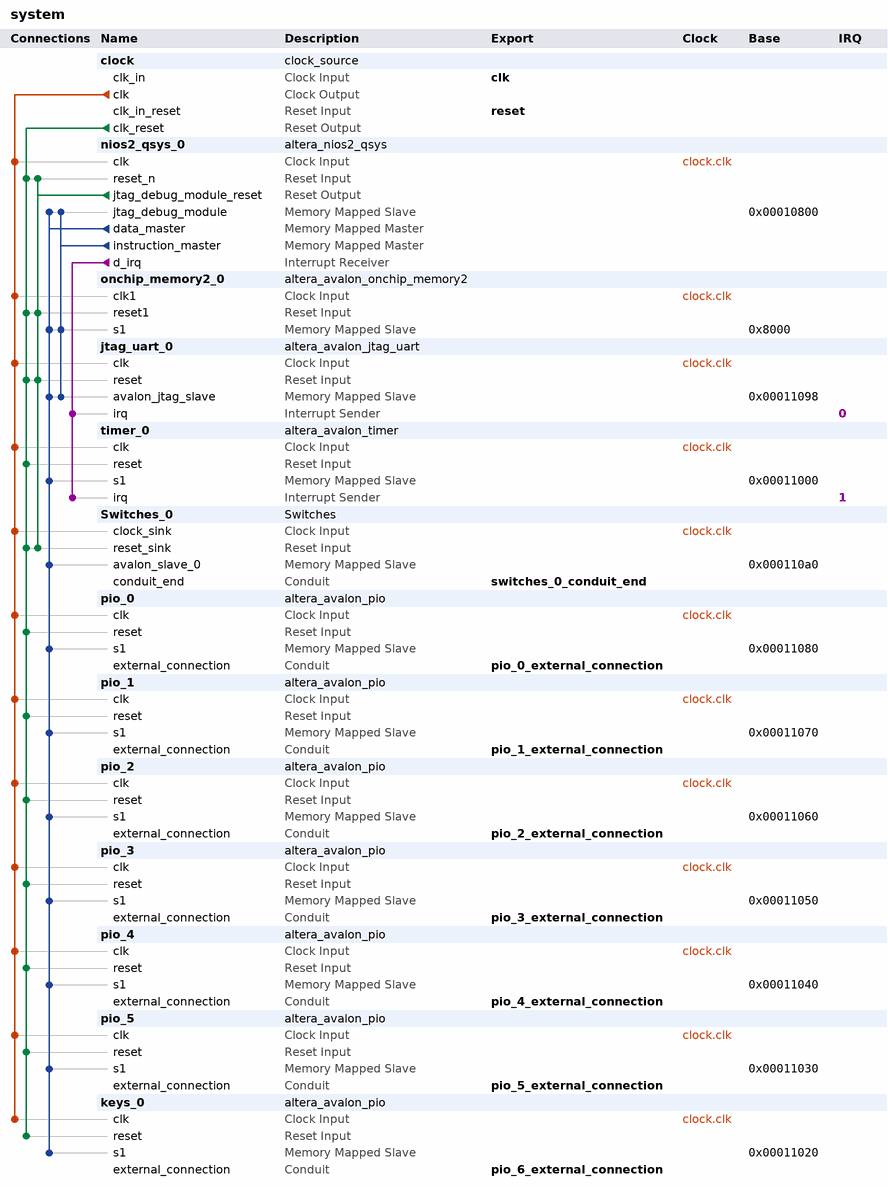
[diagram p0: system contents]
# Platform Designer (Qsys) system system, Cyclone II EP2C35F672C6
# Parameters at their usual value, and those the tool derives, are not listed.
package require -exact qsys 13.0.1.99.2
create_system system
set_project_property DEVICE_FAMILY {Cyclone II}
set_project_property DEVICE EP2C35F672C6

add_instance clock clock_source 13.0
set_instance_parameter_value clock clockFrequency 50000000

add_instance nios2_qsys_0 altera_nios2_qsys 13.0
set_instance_parameter_value nios2_qsys_0 resetSlave onchip_memory2_0.s1
set_instance_parameter_value nios2_qsys_0 mmu_TLBMissExcSlave None
set_instance_parameter_value nios2_qsys_0 exceptionSlave onchip_memory2_0.s1
set_instance_parameter_value nios2_qsys_0 breakSlave nios2_qsys_0.jtag_debug_module
set_instance_parameter_value nios2_qsys_0 impl Tiny
set_instance_parameter_value nios2_qsys_0 icache_size 4096

add_instance onchip_memory2_0 altera_avalon_onchip_memory2 13.0.1.99.2
set_instance_parameter_value onchip_memory2_0 dataWidth 32
set_instance_parameter_value onchip_memory2_0 dualPort false
set_instance_parameter_value onchip_memory2_0 initMemContent true
set_instance_parameter_value onchip_memory2_0 initializationFileName onchip_mem.hex
set_instance_parameter_value onchip_memory2_0 memorySize 32768

add_instance jtag_uart_0 altera_avalon_jtag_uart 13.0.1.99.2
set_instance_parameter_value jtag_uart_0 simInteractiveOptions NO_INTERACTIVE_WINDOWS

add_instance timer_0 altera_avalon_timer 13.0.1.99.2
set_instance_parameter_value timer_0 period 1
set_instance_parameter_value timer_0 periodUnits MSEC

add_instance Switches_0 Switches 1.0

add_instance pio_0 altera_avalon_pio 13.0.1.99.2
set_instance_parameter_value pio_0 direction Output
set_instance_parameter_value pio_0 width 8

add_instance pio_1 altera_avalon_pio 13.0.1.99.2
set_instance_parameter_value pio_1 direction Output
set_instance_parameter_value pio_1 width 8

add_instance pio_2 altera_avalon_pio 13.0.1.99.2
set_instance_parameter_value pio_2 direction Output
set_instance_parameter_value pio_2 width 4

add_instance pio_3 altera_avalon_pio 13.0.1.99.2
set_instance_parameter_value pio_3 direction Output
set_instance_parameter_value pio_3 width 4

add_instance pio_4 altera_avalon_pio 13.0.1.99.2
set_instance_parameter_value pio_4 direction Output
set_instance_parameter_value pio_4 width 4

add_instance pio_5 altera_avalon_pio 13.0.1.99.2
set_instance_parameter_value pio_5 direction Output
set_instance_parameter_value pio_5 width 4

add_instance keys_0 altera_avalon_pio 13.0.1.99.2
set_instance_parameter_value keys_0 captureEdge true
set_instance_parameter_value keys_0 direction Input
set_instance_parameter_value keys_0 irqType EDGE
set_instance_parameter_value keys_0 width 1

# connections
add_connection clock.clk jtag_uart_0.clk clock
add_connection clock.clk keys_0.clk clock
add_connection clock.clk nios2_qsys_0.clk clock
add_connection clock.clk onchip_memory2_0.clk1 clock
add_connection clock.clk pio_0.clk clock
add_connection clock.clk pio_1.clk clock
add_connection clock.clk pio_2.clk clock
add_connection clock.clk pio_3.clk clock
add_connection clock.clk pio_4.clk clock
add_connection clock.clk pio_5.clk clock
add_connection clock.clk Switches_0.clock_sink clock
add_connection clock.clk timer_0.clk clock
add_connection clock.clk_reset jtag_uart_0.reset reset
add_connection clock.clk_reset keys_0.reset reset
add_connection clock.clk_reset nios2_qsys_0.reset_n reset
add_connection clock.clk_reset onchip_memory2_0.reset1 reset
add_connection clock.clk_reset pio_0.reset reset
add_connection clock.clk_reset pio_1.reset reset
add_connection clock.clk_reset pio_2.reset reset
add_connection clock.clk_reset pio_3.reset reset
add_connection clock.clk_reset pio_4.reset reset
add_connection clock.clk_reset pio_5.reset reset
add_connection clock.clk_reset Switches_0.reset_sink reset
add_connection clock.clk_reset timer_0.reset reset
add_connection nios2_qsys_0.jtag_debug_module_reset jtag_uart_0.reset reset
add_connection nios2_qsys_0.jtag_debug_module_reset nios2_qsys_0.reset_n reset
add_connection nios2_qsys_0.jtag_debug_module_reset onchip_memory2_0.reset1 reset
add_connection nios2_qsys_0.jtag_debug_module_reset Switches_0.reset_sink reset
add_connection nios2_qsys_0.data_master jtag_uart_0.avalon_jtag_slave avalon
set_connection_parameter_value nios2_qsys_0.data_master/jtag_uart_0.avalon_jtag_slave baseAddress 0x00011098
add_connection nios2_qsys_0.data_master keys_0.s1 avalon
set_connection_parameter_value nios2_qsys_0.data_master/keys_0.s1 baseAddress 0x00011020
add_connection nios2_qsys_0.data_master nios2_qsys_0.jtag_debug_module avalon
set_connection_parameter_value nios2_qsys_0.data_master/nios2_qsys_0.jtag_debug_module baseAddress 0x00010800
add_connection nios2_qsys_0.data_master onchip_memory2_0.s1 avalon
set_connection_parameter_value nios2_qsys_0.data_master/onchip_memory2_0.s1 baseAddress 0x8000
add_connection nios2_qsys_0.data_master pio_0.s1 avalon
set_connection_parameter_value nios2_qsys_0.data_master/pio_0.s1 baseAddress 0x00011080
add_connection nios2_qsys_0.data_master pio_1.s1 avalon
set_connection_parameter_value nios2_qsys_0.data_master/pio_1.s1 baseAddress 0x00011070
add_connection nios2_qsys_0.data_master pio_2.s1 avalon
set_connection_parameter_value nios2_qsys_0.data_master/pio_2.s1 baseAddress 0x00011060
add_connection nios2_qsys_0.data_master pio_3.s1 avalon
set_connection_parameter_value nios2_qsys_0.data_master/pio_3.s1 baseAddress 0x00011050
add_connection nios2_qsys_0.data_master pio_4.s1 avalon
set_connection_parameter_value nios2_qsys_0.data_master/pio_4.s1 baseAddress 0x00011040
add_connection nios2_qsys_0.data_master pio_5.s1 avalon
set_connection_parameter_value nios2_qsys_0.data_master/pio_5.s1 baseAddress 0x00011030
add_connection nios2_qsys_0.data_master Switches_0.avalon_slave_0 avalon
set_connection_parameter_value nios2_qsys_0.data_master/Switches_0.avalon_slave_0 baseAddress 0x000110a0
add_connection nios2_qsys_0.data_master timer_0.s1 avalon
set_connection_parameter_value nios2_qsys_0.data_master/timer_0.s1 baseAddress 0x00011000
add_connection nios2_qsys_0.instruction_master jtag_uart_0.avalon_jtag_slave avalon
set_connection_parameter_value nios2_qsys_0.instruction_master/jtag_uart_0.avalon_jtag_slave baseAddress 0x00011098
add_connection nios2_qsys_0.instruction_master nios2_qsys_0.jtag_debug_module avalon
set_connection_parameter_value nios2_qsys_0.instruction_master/nios2_qsys_0.jtag_debug_module baseAddress 0x00010800
add_connection nios2_qsys_0.instruction_master onchip_memory2_0.s1 avalon
set_connection_parameter_value nios2_qsys_0.instruction_master/onchip_memory2_0.s1 baseAddress 0x8000
add_connection nios2_qsys_0.d_irq jtag_uart_0.irq interrupt
set_connection_parameter_value nios2_qsys_0.d_irq/jtag_uart_0.irq irqNumber 0
add_connection nios2_qsys_0.d_irq timer_0.irq interrupt
set_connection_parameter_value nios2_qsys_0.d_irq/timer_0.irq irqNumber 1

# exported interfaces
add_interface clk clock sink
set_interface_property clk EXPORT_OF clock.clk_in
add_interface reset reset sink
set_interface_property reset EXPORT_OF clock.clk_in_reset
add_interface switches_0_conduit_end conduit end
set_interface_property switches_0_conduit_end EXPORT_OF Switches_0.conduit_end
add_interface pio_0_external_connection conduit end
set_interface_property pio_0_external_connection EXPORT_OF pio_0.external_connection
add_interface pio_1_external_connection conduit end
set_interface_property pio_1_external_connection EXPORT_OF pio_1.external_connection
add_interface pio_2_external_connection conduit end
set_interface_property pio_2_external_connection EXPORT_OF pio_2.external_connection
add_interface pio_3_external_connection conduit end
set_interface_property pio_3_external_connection EXPORT_OF pio_3.external_connection
add_interface pio_4_external_connection conduit end
set_interface_property pio_4_external_connection EXPORT_OF pio_4.external_connection
add_interface pio_5_external_connection conduit end
set_interface_property pio_5_external_connection EXPORT_OF pio_5.external_connection
add_interface pio_6_external_connection conduit end
set_interface_property pio_6_external_connection EXPORT_OF keys_0.external_connection

set_interconnect_requirement {$system} qsys_mm.clockCrossingAdapter HANDSHAKE
set_interconnect_requirement {$system} qsys_mm.maxAdditionalLatency 1

save_system system.qsys
